# Altium schematic sheet peripherals.SchDoc
size A
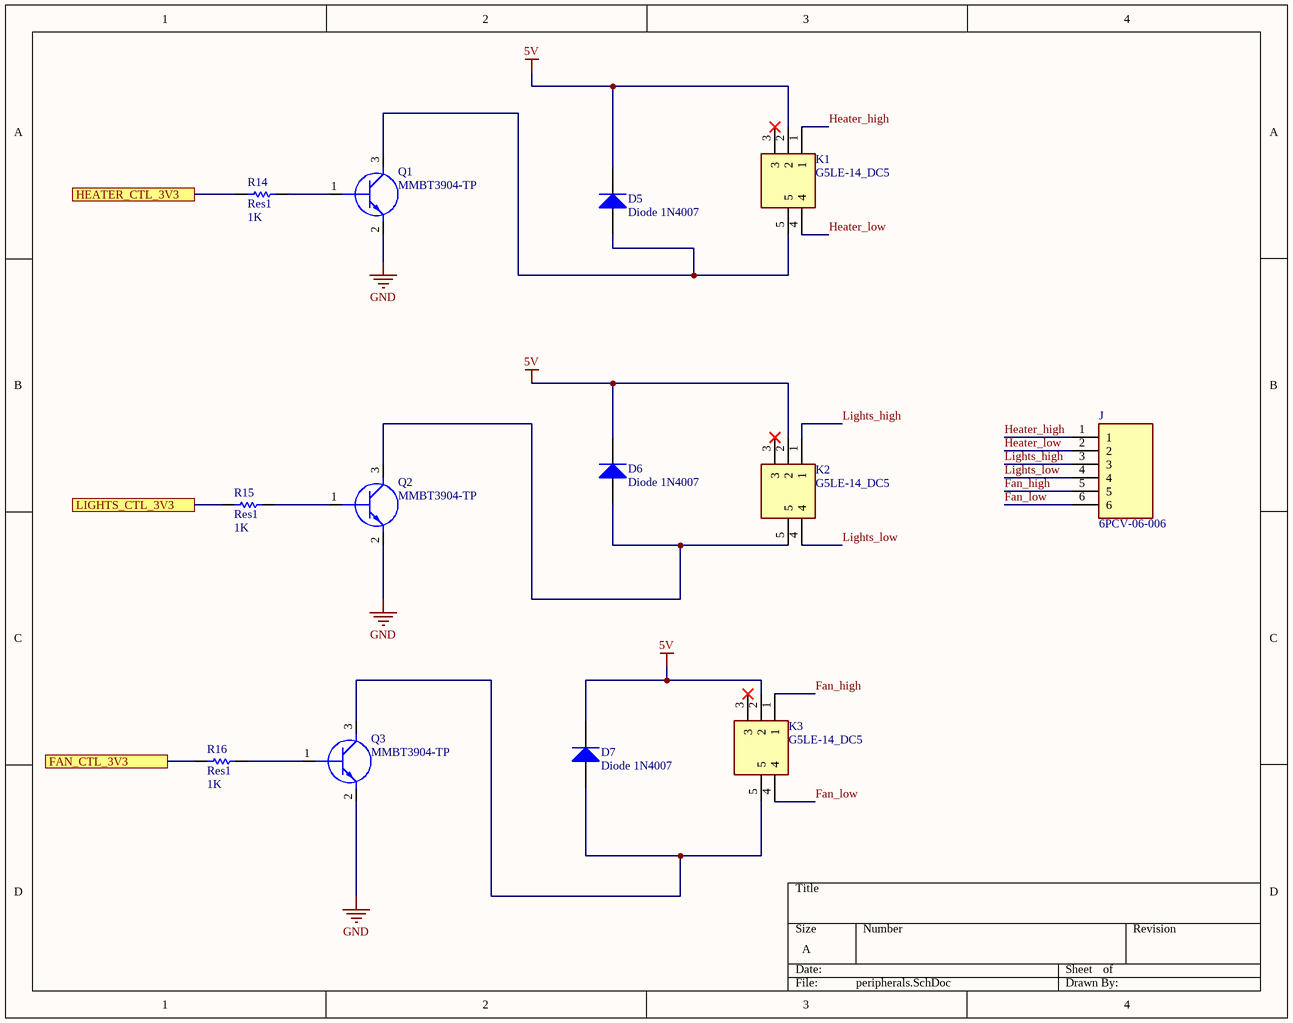
[diagram p0: peripherals.SchDoc]

## Parts
D5  Diode 1N4007  [DO-41]
D6  Diode 1N4007  [DO-41]
D7  Diode 1N4007  [DO-41]
J  6PCV-06-006  [TE_9-1437652-5]
K1  G5LE-14_DC5  [G5LE-1A]
K2  G5LE-14_DC5  [G5LE-1A]
K3  G5LE-14_DC5  [G5LE-1A]
Q1  MMBT3904-TP  [SI2305TP]
Q2  MMBT3904-TP  [SI2305TP]
Q3  MMBT3904-TP  [SI2305TP]
R14  Res1  value 1K  [AXIAL-0.3]
R15  Res1  value 1K  [AXIAL-0.3]
R16  Res1  value 1K  [AXIAL-0.3]

## Ports
FAN_CTL_3V3, HEATER_CTL_3V3, LIGHTS_CTL_3V3

## Nets
5V: D5.2(K) D6.2(K) D7.2(K) K1.2 K2.2 K3.2
GND: Q1.2(E) Q2.2(E) Q3.2(E)
FAN_CTL_3V3: R16.1 ; port FAN_CTL_3V3
Fan_high: J.5 K3.1
Fan_low: J.6 K3.4
HEATER_CTL_3V3: R14.1 ; port HEATER_CTL_3V3
Heater_high: J.1 K1.1
Heater_low: J.2 K1.4
LIGHTS_CTL_3V3: R15.1 ; port LIGHTS_CTL_3V3
Lights_high: J.3 K2.1
Lights_low: J.4 K2.4
NetD5_1: D5.1(A) K1.5 Q1.3(C)
NetD6_1: D6.1(A) K2.5 Q2.3(C)
NetD7_1: D7.1(A) K3.5 Q3.3(C)
NetQ1_1: Q1.1(B) R14.2
NetQ2_1: Q2.1(B) R15.2
NetQ3_1: Q3.1(B) R16.2

Not connected (* = marked no-connect by the designer): K1 3*; K2 3*; K3 3*

## Library data of the parts
D5-D7 = Diode 1N4007: 1 Amp General Purpose Rectifier; Published: 8-Jun-2000; LatestRevisionDate: 17-Jul-2002; LatestRevisionNote: Re-released for DXP Platform.; DatasheetVersion: 1998; PackageVersion: Aug-1999; PackageReference: DO-41; Publisher: Altium Limited; PackageDescription: Diode, Axial; Body 5.2 x 2.7 mm (LxDia. max), Lead Dia. 0.86 mm (max); Code_JEDEC: DO-204-AL; ComponentLink1Description: Manufacturer Link; ComponentLink1URL: http://www.fairchildsemi.com/; ComponentLink2Description: Datasheet; ComponentLink2URL: http://www.fairchildsemi.com/ds/1N%2F1N4001.pdf
J = 6PCV-06-006: Buchanan 6 Position 9.53 mm Pitch Single Row 12-22 AWG Tri-Barrier Strip; MF: TE Connectivity; MP: 6PCV-06-006; Value: *; TE_purchase_URL: https://www.te.com/usa-en/product-9-1437652-5.html?te_bu=Cor&te_type=disp&te_campaign=seda_glo_cor-seda-global-disp-prtnr-fy19-seda-model-bom-cta_sma-317_1&elqCampaignId=32493; SnapEDA_Link: https://www.snapeda.com/parts/6PCV-06-006/TE%20Connectivity%20AMP%20Connectors/view-part/2782422/?ref=snap; Price: None; Package: None; Availability: Unavailable
K1-K3 = G5LE-14_DC5: Relay or Contactor; Manufacturer_Name: Omron Electronics; Manufacturer_Part_Number: G5LE-14 DC5; Datasheet Link: http://omronfs.omron.com/en_US/ecb/products/pdf/en-g5le.pdf
Q1-Q3 = MMBT3904-TP: Transistor BJT NPN; Manufacturer_Name: Micro Commercial Components (MCC); Datasheet Link: https://componentsearchengine.com/Datasheets/1/MMBT3904-TP.pdf; Manufacturer_Part_Number: MMBT3904-TP; Mouser Part Number: 833-MMBT3904-TP; Mouser Price/Stock: https://www.mouser.co.uk/ProductDetail/Micro-Commercial-Components-MCC/MMBT3904-TP/?qs=KFo7JewZbUHicjDjIayULQ%3D%3D; Arrow Part Number: MMBT3904-TP; Arrow Price/Stock: https://www.arrow.com/en/products/mmbt3904-tp/micro-commercial-components
R14-R16 = Res1: Resistor; Published: 8-Jun-2000; LatestRevisionDate: 17-Jul-2002; LatestRevisionNote: Re-released for DXP Platform.; PackageReference: AXIAL-0.3; Publisher: Altium Limited; PackageDescription: Axial Device, Thru-Hole; 2 Leads; 0.3 in Pin Spacing